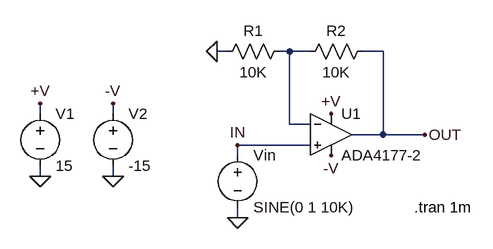
[diagram p0: schematic ADA4177-2.asc]
ADA4177-2.asc, the LTspice schematic file:
Version 4
SHEET 1 1240 700
WIRE 416 -1232 400 -1232
WIRE 512 -1232 496 -1232
WIRE 544 -1232 512 -1232
WIRE 656 -1232 624 -1232
WIRE 128 -1136 128 -1152
WIRE 240 -1136 240 -1152
WIRE 512 -1120 512 -1232
WIRE 544 -1120 512 -1120
WIRE 656 -1104 656 -1232
WIRE 656 -1104 608 -1104
WIRE 720 -1104 656 -1104
WIRE 544 -1088 432 -1088
WIRE 432 -1072 432 -1088
WIRE 128 -1040 128 -1056
WIRE 240 -1040 240 -1056
WIRE 432 -976 432 -992
FLAG 128 -1152 +V
FLAG 128 -1040 0
FLAG 432 -976 0
FLAG 720 -1104 OUT
FLAG 432 -1088 IN
FLAG 576 -1136 +V
FLAG 240 -1152 -V
FLAG 576 -1072 -V
FLAG 400 -1232 0
FLAG 240 -1040 0
SYMBOL voltage 128 -1152 R0
WINDOW 123 0 0 Left 2
WINDOW 39 0 0 Left 2
SYMATTR InstName V1
SYMATTR Value 15
SYMBOL voltage 432 -1088 R0
WINDOW 123 24 146 Left 2
WINDOW 39 24 125 Left 2
SYMATTR InstName Vin
SYMATTR Value SINE(0 1 10K)
SYMBOL res 512 -1248 R90
WINDOW 0 0 56 VBottom 2
WINDOW 3 32 56 VTop 2
SYMATTR InstName R1
SYMATTR Value 10K
SYMBOL res 640 -1248 R90
WINDOW 0 0 56 VBottom 2
WINDOW 3 32 56 VTop 2
SYMATTR InstName R2
SYMATTR Value 10K
SYMBOL voltage 240 -1152 R0
WINDOW 123 24 146 Left 2
WINDOW 39 24 125 Left 2
SYMATTR InstName V2
SYMATTR Value -15
SYMBOL opamps\\ADA4177-2 576 -1104 R0
SYMATTR InstName U1
TEXT 704 -992 Left 2 !.tran 1m

The netlist it stands for:
* ADA4177-2.asc
V1 +V 0 15
Vin IN 0 SINE(0 1 10K)
R1 N001 0 10K
R2 OUT N001 10K
V2 -V 0 -15
* U1: ADA4177-2 (symbol opamps\ADA4177-2 not available, pins judged from their places): In+=IN In-=N001 V+=+V V-=-V OUT=OUT
.tran 1m
.backanno
.end